# EAGLE design Preamp_Schematic (EAGLE 7.3.0)
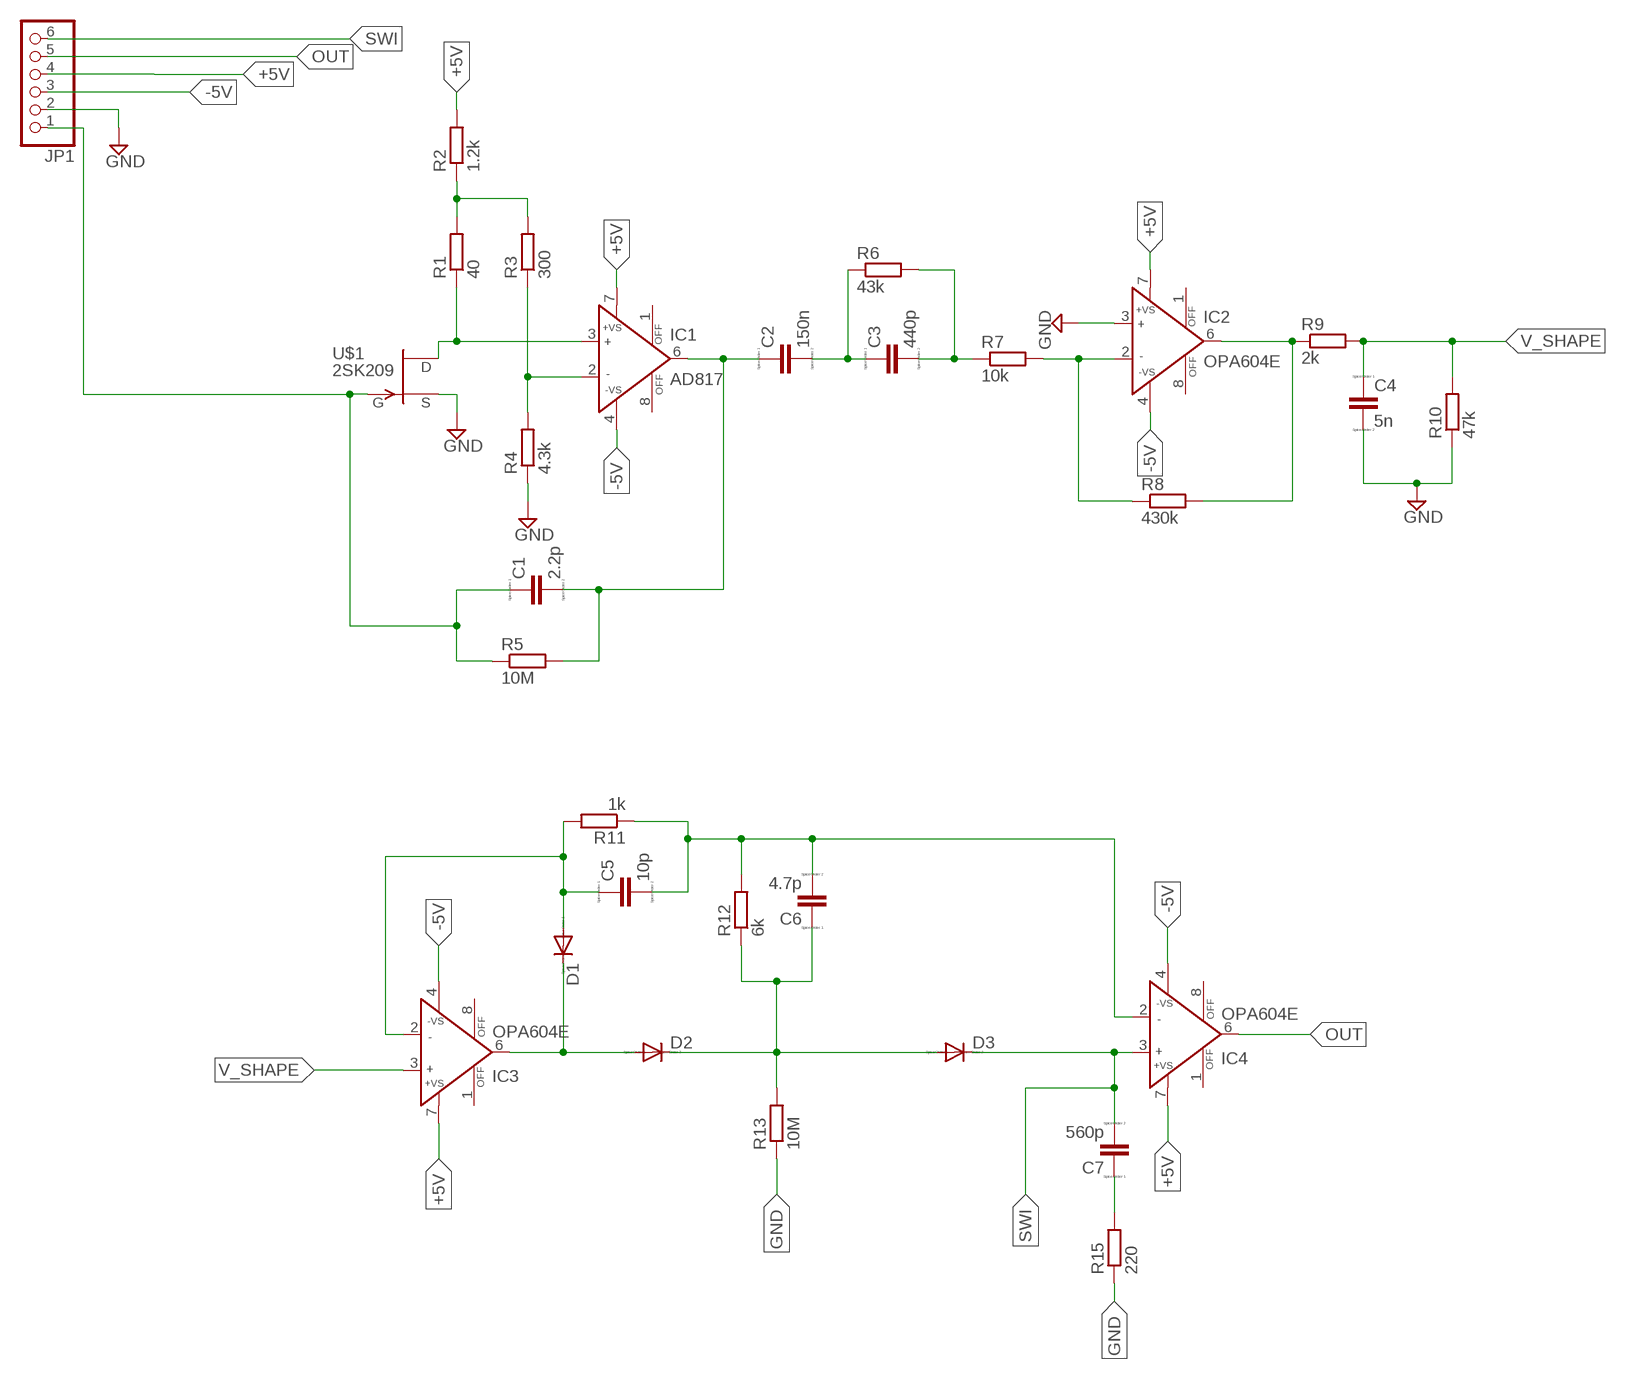
[diagram p0: schematic, sheet 1]

## Parts
C1  2.2p  C  [C0805]
C2  150n  C  [C0805]
C3  440p  C  [C0805]
C4  5n  C  [C0805]
C5  10p  C  [C0805]
C6  4.7p  C  [C0805]
C7  560p  C  [C0805]
D1  DIODE-SOD123  [SOD123]
D2  DIODE-SOD123  [SOD123]
D3  DIODE-SOD123  [SOD123]
IC1  AD817  [SO8]
IC2  OPA604E  AD817  [SO8]
IC3  OPA604E  AD817  [SO8]
IC4  OPA604E  AD817  [SO8]
JP1  PINHD-1X6-3.5MM  [1X06-3.5MM]
R1  40  R-EU_R0805  [R0805]
R2  1.2k  R-EU_R0805  [R0805]
R3  300  R-EU_R0805  [R0805]
R4  4.3k  R-EU_R0805  [R0805]
R5  10M  R-EU_R0805  [R0805]
R6  43k  R-EU_R0805  [R0805]
R7  10k  R-EU_R0805  [R0805]
R8  430k  R-EU_R0805  [R0805]
R9  2k  R-EU_R0805  [R0805]
R10  47k  R-EU_R0805  [R0805]
R11  1k  R-EU_R0805  [R0805]
R12  6k  R-EU_R0805  [R0805]
R13  10M  R-EU_R0805  [R0805]
R15  220  R-EU_R0805  [R0805]
U$1  2SK209  [2SK209]

## Nets
+5V: IC1.7(+VS) IC2.7(+VS) IC3.7(+VS) IC4.7(+VS) JP1.4 R2.2
-5V: IC1.4(-VS) IC2.4(-VS) IC3.4(-VS) IC4.4(-VS) JP1.3
GND: C4.2 IC2.3(IN+) JP1.2 R4.1 R10.1 R13.1 R15.1 U$1.S
N$2: C1.2 C2.1 IC1.6(OUT) R5.2
N$3: C2.2 C3.1 R6.1
N$4: C3.2 R6.2 R7.1
N$5: R1.2 R2.1 R3.2
N$6: IC2.2(IN-) R7.2 R8.1
N$7: IC1.3(IN+) R1.1 U$1.D
N$8: IC2.6(OUT) R8.2 R9.1
N$9: IC1.2(IN-) R3.1 R4.2
N$11: D1.C D2.A IC3.6(OUT)
N$12: C5.1 D1.A IC3.2(IN-) R11.2
N$13: C5.2 C6.2 IC4.2(IN-) R11.1 R12.2
N$14: C6.1 D2.C D3.A R12.1 R13.2
N$16: C7.1 R15.2
OUT: IC4.6(OUT) JP1.5
SWI: C7.2 D3.C IC4.3(IN+) JP1.6
V_SHAPE: C4.1 IC3.3(IN+) R9.2 R10.2
VIN: C1.1 JP1.1 R5.1 U$1.G
Unconnected: IC1.1(OFF) IC1.8(OFF) IC2.1(OFF) IC2.8(OFF) IC3.1(OFF) IC3.8(OFF) IC4.1(OFF) IC4.8(OFF)

## Library data of the parts
C1-C7 = eagle-ltspice:C: CAPACITOR, European symbol; SPICEMODEL: NONE; SPICEPREFIX: C
D1-D3 = diode:DIODE-: DIODE
IC1-IC4 = analog-devices:AD817: High Speed, Low Power Wide Supply Range Amplifier Source: http://www.analog.com/static/imported-files/data_sheets/AD817.pdf; MF: ALTERA CORPORATION; MPN: AD817ARZ; OC_FARNELL: 1660992; OC_NEWARK: 88H0179
JP1 = adafruit:PINHD-1X6: PIN HEADER
R1-R13 R15 = resistor:R-EU_: RESISTOR, European symbol
U$1 = RadonCustom:2SK209

## Net classes
0 default: width 0.305 mm, drill 0.508 mm, clearance 0.254 mm

## Board
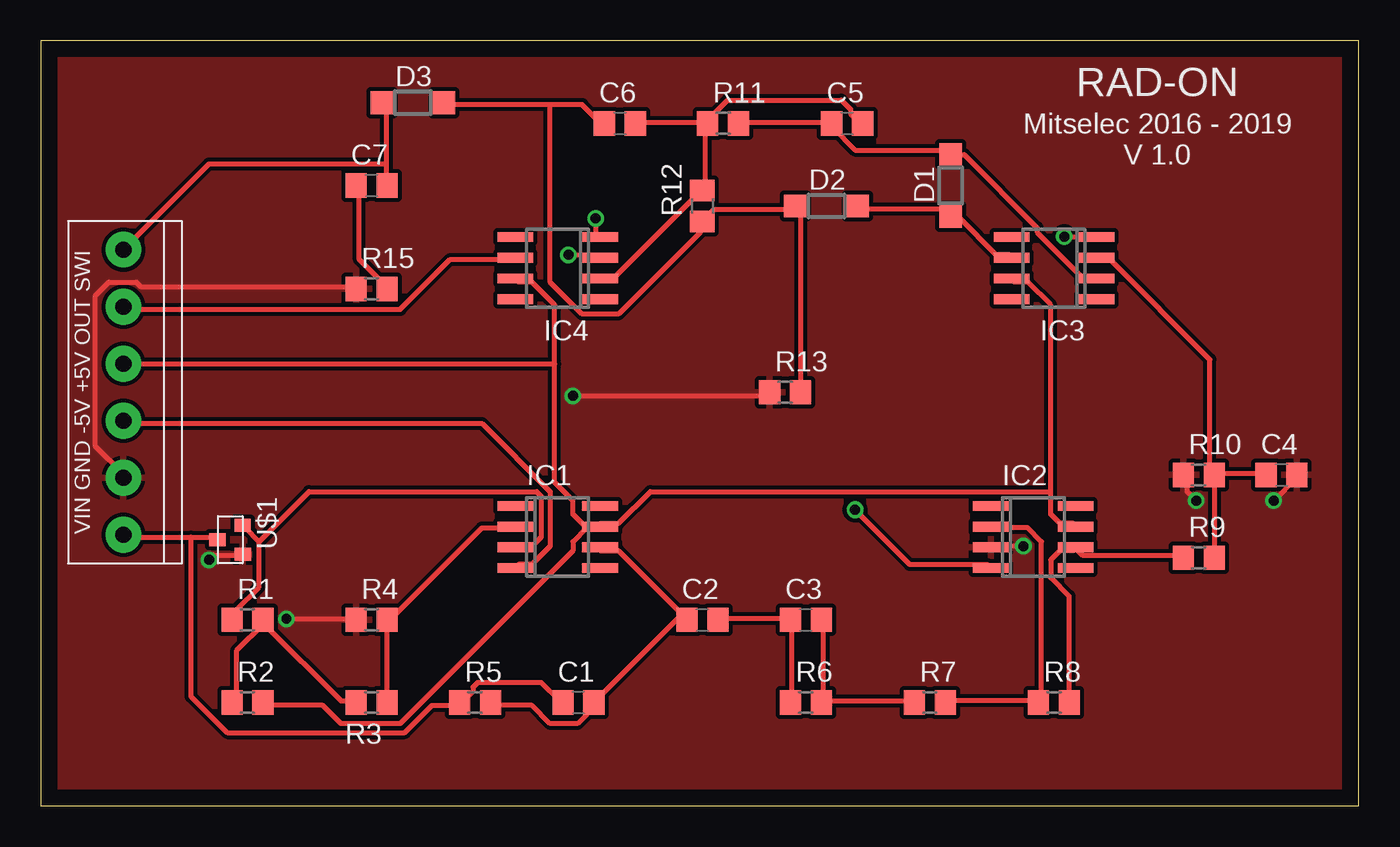
[diagram p1: board, top side]
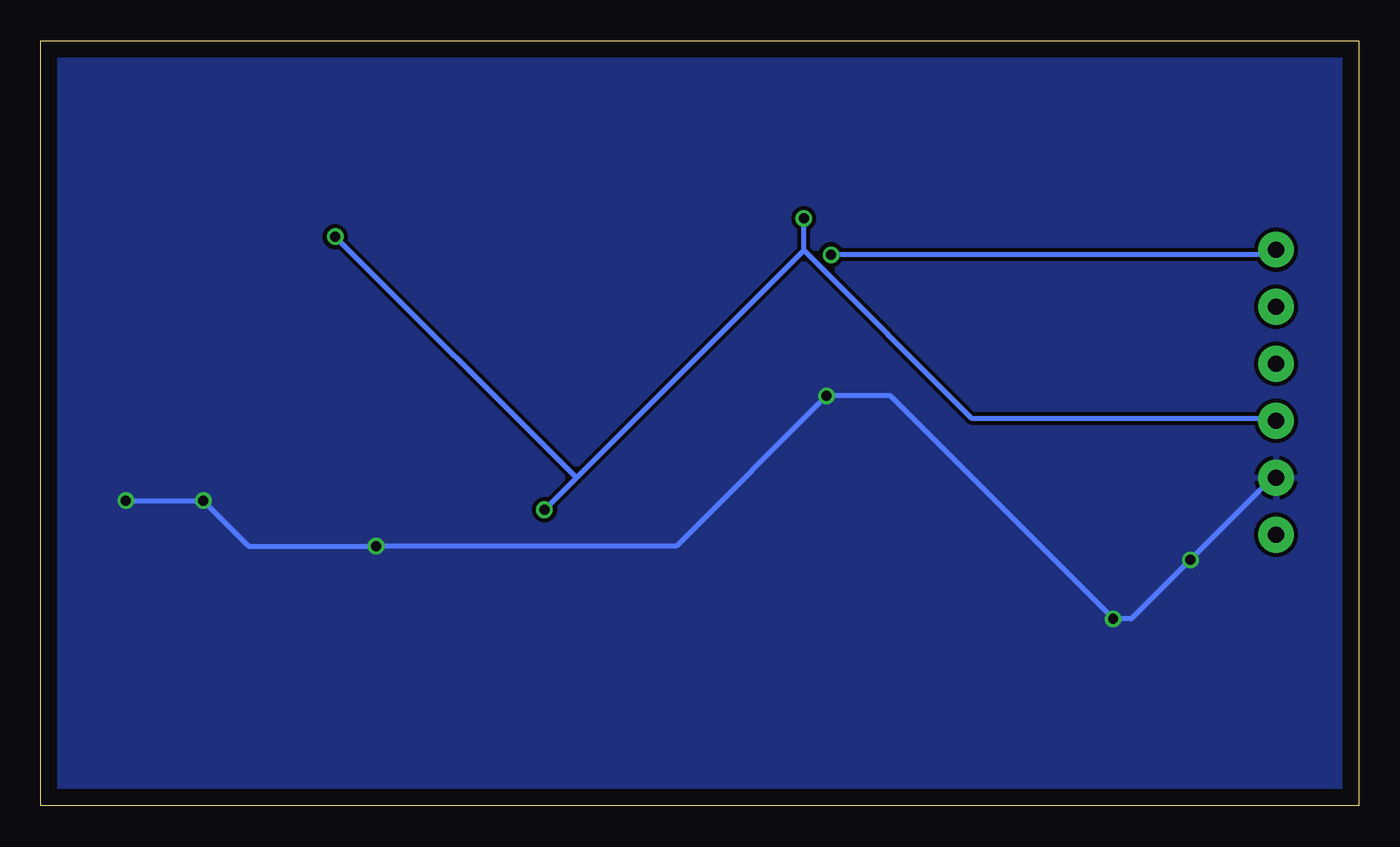
[diagram p2: board, bottom side, seen from below]

Size 80.95 x 46.98 mm. Coordinates in mm from the lower left corner, seen from the top.
Outline: 0,0 80.95,0 80.95,46.98 0,46.98 0,0
Copper layers (1*16): Top 0.035mm / dielectric 1.5mm / Bottom 0.035mm
Design rules "default": minimum track width 10mil, minimum drill 24mil, track to track 8mil, track to pad 8mil, pad to pad 8mil, via to via 8mil, smd to smd 8mil, copper to edge 40mil, drill to drill 8mil, minimum pad ring 10mil, minimum via ring 8mil, stop-mask expansion 4mil, vias tented up to drill 0mil, thermal gap 10mil

### Footprints (pad centres in the part's own frame; a part is rotated, then mirrored left to right if it is on the bottom)
C0805 = smd 1.3 x 1.5: 1 -0.95,0; 2 0.95,0
SOD123 = smd 1.4 x 1.4: A 1.9,0; C -1.9,0
SO8 = smd 0.6 x 2.2: 1 -1.905,-2.6; 2 -0.635,-2.6; 3 0.635,-2.6; 4 1.905,-2.6; 5 1.905,2.6; 6 0.635,2.6; 7 -0.635,2.6; 8 -1.905,2.6
1X06-3.5MM = drill 1 pad 2.184: 1 -8.75,0; 2 -5.25,0; 3 -1.75,0; 4 1.75,0; 5 5.25,0; 6 8.75,0
R0805 = smd 1.3 x 1.5: 1 -0.95,0; 2 0.95,0
2SK209 = smd 0.8 x 1: D 4.545,2.835; G 3.64,4.38; S 2.75,2.83

### Placement (x,y rotation side)
C1  33.02,6.35 0 top
C2  40.64,11.43 0 top
C3  46.99,11.43 0 top
C4  76.2,20.32 0 top
C5  49.53,41.91 0 top
C6  35.56,41.91 0 top
C7  20.32,38.1 0 top
D1  55.88,38.1 90 top
D2  48.26,36.83 0 top
D3  22.86,43.18 0 top
IC1  31.75,16.51 270 top
IC2  60.96,16.51 270 top
IC3  62.23,33.02 90 top
IC4  31.75,33.02 90 top
JP1  5.08,25.4 90 top
R1  12.7,11.43 0 top
R2  12.7,6.35 0 top
R3  20.32,6.35 180 top
R4  20.32,11.43 0 top
R5  26.67,6.35 0 top
R6  46.99,6.35 0 top
R7  54.61,6.35 0 top
R8  62.23,6.35 0 top
R9  71.12,15.24 0 top
R10  71.12,20.32 0 top
R11  41.91,41.91 0 top
R12  40.64,36.83 90 top
R13  45.72,25.4 0 top
R15  20.32,31.75 0 top
U$1  15.24,12.7 90 top

### Tracks (layer width: path | path; a pad name or v marks a point on that pad's centre or on a via)
+5V
  Top 0.305: 62.03,19.3 62.03,17.91 62.59,17.35 63.42,17.35 IC2.7 | 62.03,19.3 62.03,30.76 60.63,32.16 59.79,32.16 IC3.7 | 33.53,17.07 32.69,16.23 32.69,15.67 22.07,5.05 18.44,5.05 17.32,6.17 13.69,6.17 R2.2 | 33.53,17.07 34.09,17.07 IC1.7 | 31.57,27.13 31.57,19.86 32.69,18.75 32.69,17.91 33.53,17.07 | 31.57,27.13 31.57,30.76 30.18,32.16 29.34,32.16 IC4.7 | 33.53,17.07 IC1.7 | 31.57,27.13 5.31,27.13 JP1.4 | 62.03,19.3 37.44,19.3 35.48,17.35 34.37,17.35 IC1.7
-5V  (via drill 0.61)
  Top 0.305: IC1.4 29.34,14.83 30.18,14.83 31.29,15.95 31.29,19.3 27.1,23.5 5.31,23.5 JP1.3 | v34.09,36.07 34.09,34.95 IC4.4 | v50.01,18.19 53.37,14.83 58.12,14.83 IC2.4 | v62.87,34.95 64.82,34.95 IC3.4
  Bottom 0.305: 34.09,34.11 v34.09,36.07 | 34.09,34.11 23.75,23.77 5.31,23.77 JP1.3 | 34.09,34.11 48.06,20.14 | 48.06,20.14 v50.01,18.19 | 48.06,20.14 v62.87,34.95
GND  (via drill 0.61)
  Top 0.305: v70.97,18.75 70.41,19.3 70.41,20.14 R10.1 | v75.72,18.75 77.11,20.14 C4.2 | v60.35,15.95 58.4,15.95 IC2.3 | v10.34,15.11 10.62,15.39 12.29,15.39 U$1.S | v15.09,11.48 19.28,11.48 R4.1 | R15.1 19.28,31.88 6.15,31.88 5.87,32.16 4.19,32.16 3.35,31.32 3.35,22.1 5.03,20.42 JP1.2 | v32.69,25.17 44.7,25.17 R13.1
  Bottom 0.305: v75.72,18.75 v70.97,18.75 68.17,15.95 v60.35,15.95 41.91,15.95 v32.69,25.17 28.78,25.17 v15.09,11.48 13.97,11.48 v10.34,15.11 5.31,20.14 JP1.2
  pour Top: -1.27,48.26 -1.27,-3.81 82.55,-3.81 82.55,48.26
  pour Bottom: -3.81,52.07 -3.81,-7.62 86.36,-7.62 86.36,52.07
N$2
  Top 0.305: R5.2 27.66,6.17 30.18,6.17 31.29,5.05 32.97,5.05 34.09,6.17 C1.2 34.09,6.45 39.4,11.76 | 39.4,11.76 35.48,15.67 34.37,15.67 IC1.6 | 39.4,11.76 39.67,11.48 C2.1 39.4,11.76
N$3
  Top 0.305: C2.2 41.63,11.48 45.82,11.48 C3.1 46.1,11.2 46.1,6.45 R6.1
N$4
  Top 0.305: 48.06,6.45 48.06,11.2 C3.2 | 48.06,6.45 53.65,6.45 R7.1 | 48.06,6.45 R6.2
N$5
  Top 0.305: 13.69,11.2 12.01,9.53 12.01,6.45 R2.1 | 13.69,11.2 18.44,6.45 19.28,6.45 R3.2 | 13.69,11.2 R1.2
N$6
  Top 0.305: R7.2 55.6,6.45 61.19,6.45 R8.1 61.47,6.45 61.47,16.23 60.63,17.07 58.4,17.07 IC2.2
N$7
  Top 0.305: 13.41,16.23 12.57,17.07 U$1.D | 13.41,16.23 13.41,13.44 12.01,12.04 12.01,11.48 R1.1 | 13.41,16.23 16.48,19.3 30.45,19.3 30.73,19.02 30.73,16.51 30.18,15.95 29.34,15.95 IC1.3
N$8
  Top 0.305: R8.2 63.14,6.45 63.14,12.88 62.03,13.99 62.03,15.11 62.59,15.67 63.42,15.67 IC2.6 63.7,15.67 63.98,15.39 70.13,15.39 R9.1
N$9
  Top 0.305: R3.1 21.23,6.45 21.23,11.2 R4.2 21.51,11.48 27.1,17.07 29.06,17.07 IC1.2
N$11
  Top 0.305: IC3.6 59.51,33.83 58.67,33.83 56.44,36.07 55.88,36.07 D1.C 55.88,36.35 55.6,36.63 50.29,36.63 D2.A
N$12
  Top 0.305: R11.2 43.03,41.94 48.34,41.94 C5.1 48.62,41.66 50.01,40.26 55.88,40.26 D1.A 55.88,39.98 56.72,39.98 61.19,35.51 61.19,35.23 63.98,32.44 64.82,32.44 IC3.2
N$13
  Top 0.305: 40.79,41.94 36.6,41.94 C6.2 | 40.79,41.94 42.19,43.33 49.17,43.33 49.73,42.77 49.73,42.49 50.29,41.94 C5.2 | 40.79,41.94 R11.1 40.79,41.66 40.79,38.02 R12.2 40.51,37.74 35.2,32.44 34.37,32.44 IC4.2
N$14
  Top 0.305: 31.29,43.05 33.25,43.05 34.37,41.94 C6.1 | 31.29,43.05 24.87,43.05 D3.A | R13.2 46.66,25.45 46.66,36.35 46.38,36.63 D2.C 46.1,36.63 41.35,36.63 40.79,36.07 R12.1 40.51,35.79 40.51,35.23 35.48,30.2 33.25,30.2 31.29,32.16 31.29,43.05
N$16
  Top 0.305: C7.1 19.56,38.02 19.56,33.55 21.23,31.88 R15.2
OUT
  Top 0.305: IC4.6 29.06,33.55 25.15,33.55 22.07,30.48 5.31,30.48 JP1.5
SWI  (via drill 0.61)
  Top 0.305: 21.23,39.42 21.23,38.3 C7.2 | 21.23,39.42 21.23,43.05 D3.C | v32.41,33.83 34.09,33.83 IC4.3 | 21.23,39.42 10.34,39.42 5.31,34.39 JP1.6
  Bottom 0.305: v32.41,33.83 5.59,33.83 5.31,34.11 JP1.6
V_SHAPE
  Top 0.305: R9.2 72.08,15.39 72.08,20.14 R10.2 | C4.1 75.16,20.42 72.08,20.42 R10.2 | IC3.3 65.1,33.55 65.66,33.55 71.81,27.41 71.81,20.42 R10.2
VIN
  Top 0.305: C1.1 31.85,6.45 30.73,7.57 26.82,7.57 26.54,7.29 26.54,7.01 25.98,6.45 R5.1 25.7,6.17 24.03,6.17 22.35,4.5 11.46,4.5 9.22,6.73 9.22,16.51 | 9.22,16.51 5.31,16.51 JP1.1 | 9.22,16.51 10.62,16.51 U$1.G

### Text on the board
tNames: RAD-ON | Mitselec 2016 - 2019 / V 1.0 | VIN GND -5V +5V OUT SWI